# Altium schematic sheet main.SchDoc
size A4
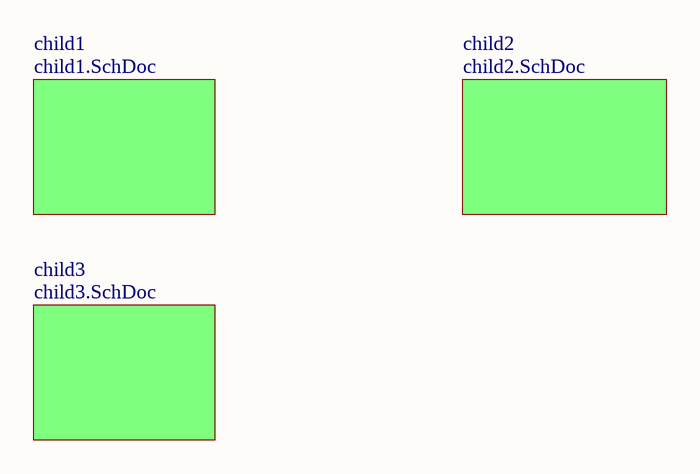
[diagram p0: main.SchDoc]

## Sub-sheets
child1 = child1.SchDoc: no entries
child2 = child2.SchDoc: no entries
child3 = child3.SchDoc: no entries